# Altium schematic sheet DP.SchDoc
size A
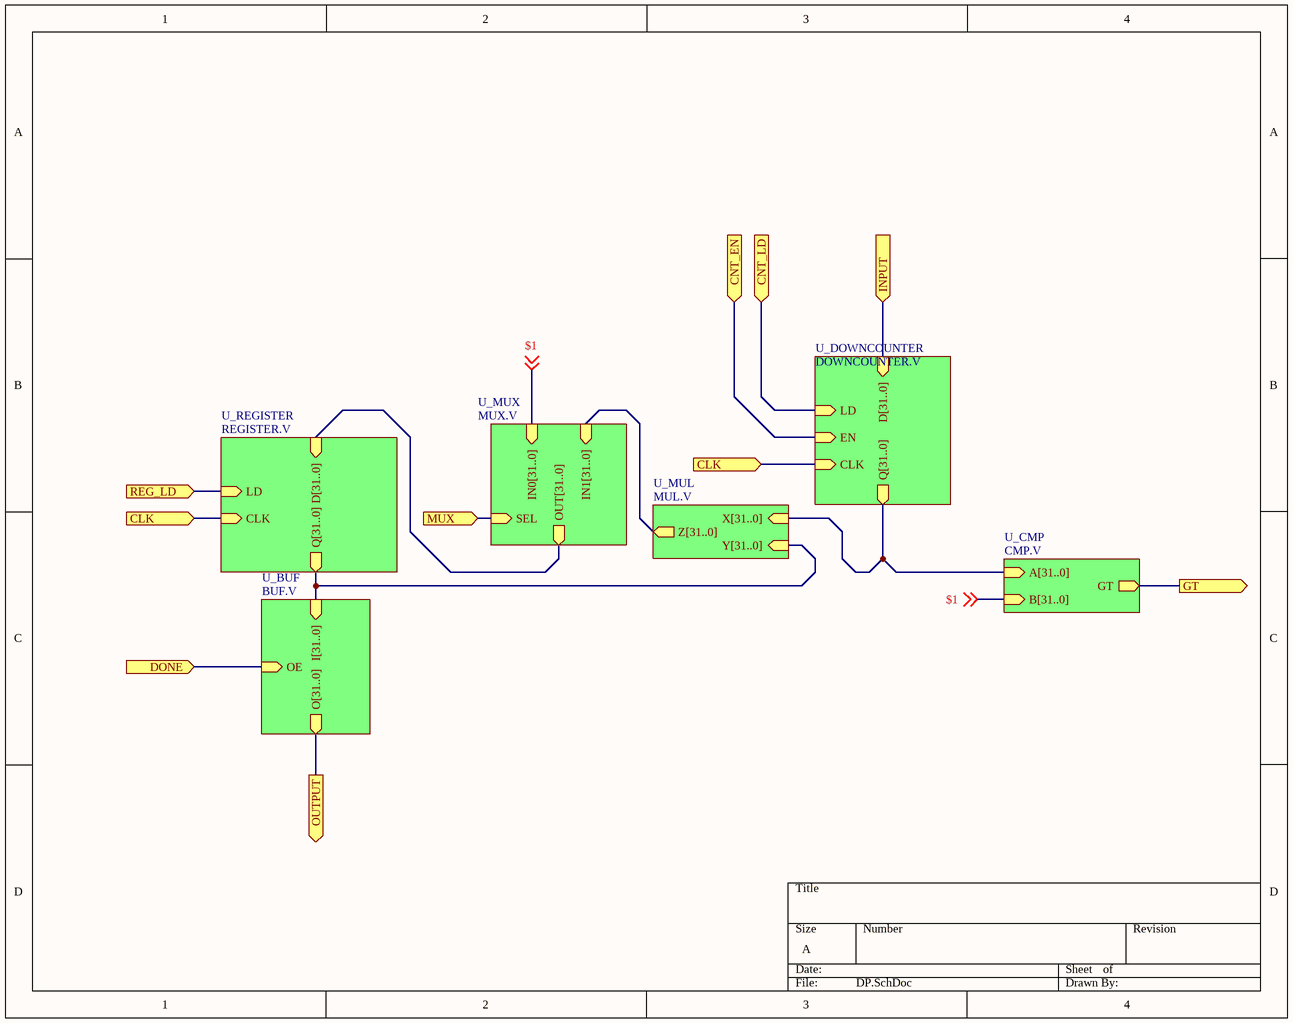
[diagram p0: DP.SchDoc]

## Sub-sheets
U_BUF = BUF.V: I[31..0] (in), O[31..0] (out), OE (in)
U_CMP = CMP.V: A[31..0] (in), B[31..0] (in), GT (out)
U_DOWNCOUNTER = DOWNCOUNTER.V: CLK (in), D[31..0] (in), EN (in), LD (in), Q[31..0] (out)
U_MUL = MUL.V: X[31..0] (in), Y[31..0] (in), Z[31..0] (out)
U_MUX = MUX.V: IN0[31..0] (in), IN1[31..0] (in), OUT[31..0] (out), SEL (in)
U_REGISTER = REGISTER.V: CLK (in), D[31..0] (in), LD (in), Q[31..0] (out)

## Ports
CLK (in), CNT_EN (in), CNT_LD (in), DONE (in), GT (out), INPUT (in), MUX (in), OUTPUT (out), REG_LD (in)

## Nets
$1: off-sheet $1, sheet U_MUX/IN0[31..0], sheet U_CMP/B[31..0]
CLK: port CLK, sheet U_DOWNCOUNTER/CLK, sheet U_REGISTER/CLK
CNT_EN: port CNT_EN, sheet U_DOWNCOUNTER/EN
CNT_LD: port CNT_LD, sheet U_DOWNCOUNTER/LD
DONE: port DONE, sheet U_BUF/OE
GT: port GT, sheet U_CMP/GT
INPUT: port INPUT, sheet U_DOWNCOUNTER/D[31..0]
MUX: port MUX, sheet U_MUX/SEL
OUTPUT: port OUTPUT, sheet U_BUF/O[31..0]
REG_LD: port REG_LD, sheet U_REGISTER/LD
(unnamed): sheet U_DOWNCOUNTER/Q[31..0], sheet U_MUL/X[31..0], sheet U_CMP/A[31..0]
(unnamed): sheet U_MUX/IN1[31..0], sheet U_MUL/Z[31..0]
(unnamed): sheet U_MUX/OUT[31..0], sheet U_REGISTER/D[31..0]
(unnamed): sheet U_REGISTER/Q[31..0], sheet U_MUL/Y[31..0], sheet U_BUF/I[31..0]